# EAGLE design EL_Inverter (EAGLE 7.2.0)
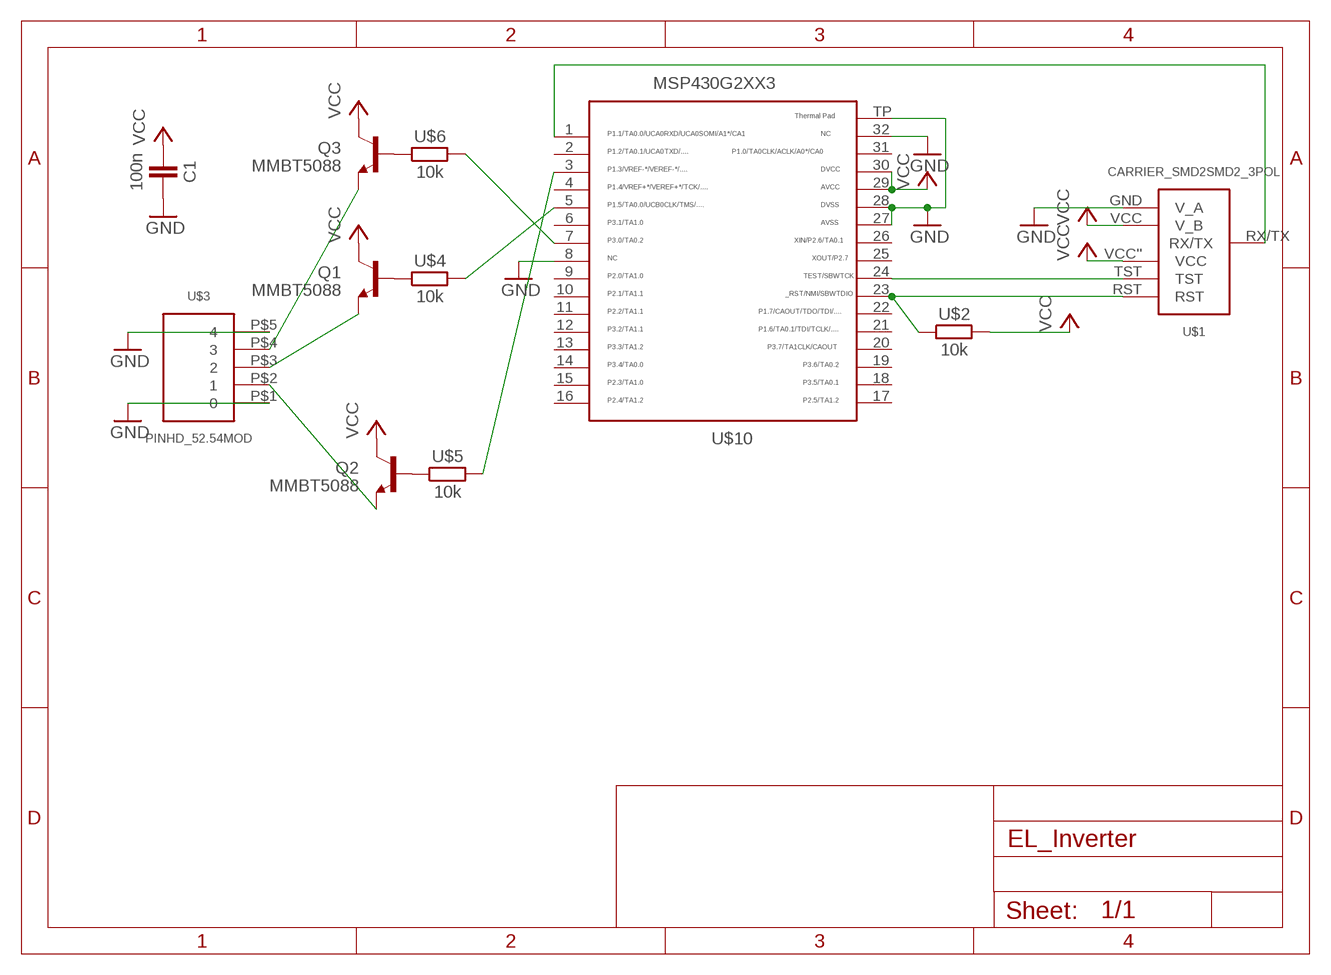
[diagram p0: schematic, sheet 1]

## Parts
C1  100n  CAPACITOR  [603]
Q1  MMBT5088  TRANSISTOR_NPNMMBT5088  [SOT23-3]
Q2  MMBT5088  TRANSISTOR_NPNMMBT5088  [SOT23-3]
Q3  MMBT5088  TRANSISTOR_NPNMMBT5088  [SOT23-3]
U$1  CARRIER_SMD2SMD2_3POL  [CARRIER_SMD2_3POL]
U$2  10k  RESISTOR0603  [603]
U$3  PINHD_52.54MOD  [PINHD_5_MOD]
U$4  10k  RESISTOR0603  [603]
U$5  10k  RESISTOR0603  [603]
U$6  10k  RESISTOR0603  [603]
U$10  MSP430G2553  [QFN32]

## Nets
GND: C1.2 U$1.GND(V_A) U$3.P$1 U$3.P$5 U$10.8 U$10.27 U$10.28 U$10.32 U$10.TP
N$2: Q1.1(B) U$4.1
N$3: U$1.TST U$10.24
N$4: U$1.RST U$2.1 U$10.23
N$5: Q2.1(B) U$5.1
N$6: Q2.2(E) U$3.P$2
N$7: Q1.2(E) U$3.P$3
N$11: Q3.1(B) U$6.1
N$12: U$1.RX/TX U$10.1
N$13: Q3.2(E) U$3.P$4
N$14: U$5.2 U$10.3
N$16: U$4.2 U$10.5
N$17: U$6.2 U$10.7
VCC: C1.1 Q1.3(C) Q2.3(C) Q3.3(C) U$1.VCC''(VCC) U$1.VCC(V_B) U$2.2 U$10.29 U$10.30
Unconnected: U$10.2 U$10.4 U$10.6 U$10.9 U$10.10 U$10.11 U$10.12 U$10.13 U$10.14 U$10.15 U$10.16 U$10.17 U$10.18 U$10.19 U$10.20 U$10.21 U$10.22 U$10.25 U$10.26 U$10.31

## Library data of the parts
C1 = thar:CAPACITOR
Q1-Q3 = SparkFun-DiscreteSemi:TRANSISTOR_NPN: Generic NPN BJT MMBT2222A - TRANS-08049 (SOT-23, 1A 40V) MPSA42 - TRANS-09116 (SOT-23, 500mA 300V) MMBT5088LT1G - TRANS-11160 (SOT-23, 50 mA 30V) BC547 - COM-08928 <http://www.sparkfun.com/products/8928> (TO-92 45V 100mA) (1.Collector 2.Base 3.Emitter) 2N3904 - COM-00521 <http://www.sparkfun.com/products/521> (TO-92 40V 200mA) (1.Emitter 2.Base 3.Collector) P2N2222A - COM-12852 <http://www.sparkfun.com/products/12852> (TO-92 40V 600mA) (1.Collector 2.Base 3.Emitter); PROD_ID: TRANS-11160
U$1 = thar:CARRIER_SMD2
U$2 U$4-U$6 = thar:RESISTOR
U$3 = thar:PINHD_5
U$10 = thar:MSP430G2553: TEXAS INSTRUMENTS MSP430G2553IRHB32R MCU, 16BIT, MSP430, 16MHZ, QFN-32 Farnell Best.Nr.: 2325726 Herst.Bez.: MSP430G2553IRHB32R

## Board
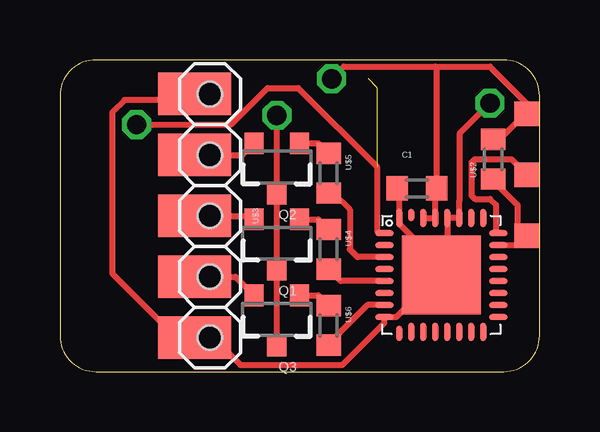
[diagram p1: board, top side]
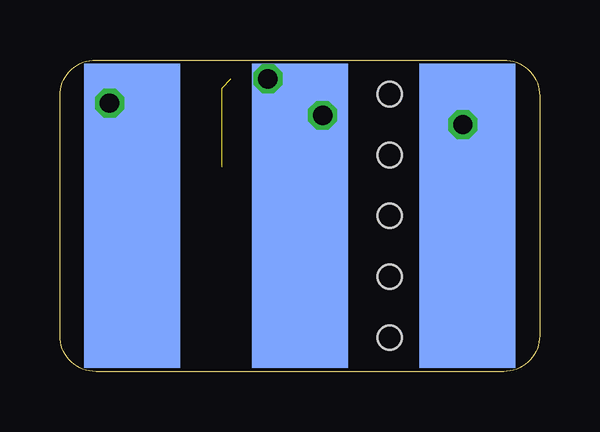
[diagram p2: board, bottom side, seen from below]

Size 20 x 13 mm. Coordinates in mm from the lower left corner, seen from the top.
Copper layers (1*16): Top 0.035mm / dielectric 1.5mm / Bottom 0.035mm
Design rules "Bilex DRU *": minimum track width 10mil, minimum drill 24mil, track to track 10mil, track to pad 10mil, pad to pad 10mil, via to via 10mil, smd to smd 10mil, copper to edge 1mil, drill to drill 8mil, minimum pad ring 10mil, minimum via ring 8mil, stop-mask expansion 4mil, vias tented up to drill 0mil, thermal gap 10mil

### Footprints (pad centres in the part's own frame; a part is rotated, then mirrored left to right if it is on the bottom)
603 = smd 0.889 x 1.016: 1 -0.826,0; 2 0.826,0
SOT23-3 = smd 0.8 x 0.9: 1 -0.95,-1; 2 0.95,-1; 3 0,1.1
CARRIER_SMD2_3POL = smd 4 x 12.7 bottom: GND -6.985,0; RX/TX 6.985,0; VCC 0,0 | smd 1.016 x 1.016: RST -9.461,0.826; TST -9.461,-1.714; VCC'' -9.461,-4.255
PINHD_5_MOD = smd 1.778 x 3.048: P$1 -5.08,-0.635; P$2 -2.54,-0.635; P$3 0,-0.635; P$4 2.54,-0.635; P$5 5.08,-0.635 | hole 1.016: -5.08,0; -2.54,0; 0,0; 2.54,0; 5.08,0
QFN32 = smd 0.762 x 0.254: 1 -2.375,1.75; 2 -2.375,1.25; 3 -2.375,0.75; 4 -2.375,0.25; 5 -2.375,-0.25; 6 -2.375,-0.75; 7 -2.375,-1.25; 8 -2.375,-1.75; 17 2.375,-1.75; 18 2.375,-1.25; 19 2.375,-0.75; 20 2.375,-0.25; 21 2.375,0.25; 22 2.375,0.75; 23 2.375,1.25; 24 2.375,1.75 | smd 0.254 x 0.635: 9 -1.75,-2.438 | smd 0.254 x 0.762: 10 -1.25,-2.375; 11 -0.75,-2.375; 12 -0.25,-2.375; 13 0.25,-2.375; 14 0.75,-2.375; 15 1.25,-2.375; 16 1.75,-2.375; 25 1.75,2.375; 26 1.25,2.375; 27 0.75,2.375; 28 0.25,2.375; 29 -0.25,2.375; 30 -0.75,2.375; 32 -1.75,2.375 | smd 0.254 x 0.508: 31 -1.25,2.5 | smd 3.302 x 3.302: TP 0,0

### Placement (x,y rotation side)
C1  14.89,7.64 180 top
Q1  9.04,5.35 180 top
Q2  9.04,8.53 180 top
Q3  9.04,2.18 180 top
U$1  10,6.5 180 top
U$2  18.06,8.86 90 top
U$3  6.25,6.5 270 top
U$4  11.2,5.1 270 top
U$5  11.2,8.28 270 top
U$6  11.2,1.92 270 top
U$10  15.9,4.03 0 top

### Tracks (layer width: path | path; a pad name or v marks a point on that pad's centre or on a via)
GND  (via drill 0.8)
  Top 0.254: 16.43,4.35 16.19,5.38 16.16,5.35 | 16.43,4.35 16.48,3.06 U$10.TP 15.01,2.94 14.89,3.14 14.03,2.28 U$10.8 13.53,2.03 11.78,0.27 7.52,0.27 6.38,1.42 U$3.P$5 4.35,1.92 3.58,2.69 2.19,4.08 2.19,10.81 2.7,11.32 4.6,11.32 4.6,11.58 U$3.P$1 | 16.15,4.72 U$10.28 U$10.27 16.65,7.12 16.66,7.13 16.66,9.93 v17.93,11.2 | 16.15,4.72 16.15,4.42 16.43,4.35 | 16.15,4.72 15.52,5.35 14.76,5.55 14.15,6.16 U$10.32 14.15,7.55 C1.2
  Bottom 0.254: 18,6.5 17.93,6.57 v17.93,11.2 16.98,10.25 U$1.GND
N$2
  Top 0.254: Q1.1 10.78,6.35 U$4.1
N$3
  Top 0.254: 19.61,7.88 19.46,8.02 19.5,8.18 | U$10.24 18.19,5.78 18.19,6.95 17.93,7.21 17.3,7.21 17.17,7.33 17.17,8.73 17.3,8.86 18.82,8.86 19.5,8.18 | 19.5,8.18 U$1.TST
N$4
  Top 0.254: 19.46,5.48 19.5,5.38 | 19.46,5.48 19.5,5.69 19.08,5.74 19.08,6.95 18.06,7.97 U$2.1 | U$10.23 19.28,5.28 19.46,5.48 | U$1.RST 19.46,5.48
N$5
  Top 0.254: Q2.1 10.78,9.53 U$5.1
N$6
  Top 0.254: U$3.P$2 7.6,9.04 Q2.2
N$7
  Top 0.254: U$3.P$3 7.95,6.5 Q1.2
N$11
  Top 0.254: Q3.1 10.78,3.18 U$6.1
N$12  (via drill 0.8)  (2 unrouted)
  Top 0.254: U$10.1 13.32,5.78 13.24,5.86 13.24,8.53 9.93,11.83 8.66,11.83 7.14,10.31 v3.2,10.31
  Bottom 0.254: U$1.RX/TX 3.01,11.77 v3.2,10.31
N$13
  Top 0.254: U$3.P$4 7.32,3.96 Q3.2
N$14
  Top 0.254: U$10.3 12.41,4.78 12.09,5.1 12.09,6.75 11.39,7.45 U$5.2
N$16
  Top 0.254: U$10.5 11.7,3.78 U$4.2
N$17
  Top 0.254: U$6.2 11.65,1.61 12.82,2.78 U$10.7
VCC  (via drill 0.8)
  Top 0.254: 19.5,10.52 19.46,10.56 | U$2.2 18.12,9.48 19.2,10.56 19.2,10.51 19.46,10.56 | 19.5,11.11 19.65,10.95 19.65,10.75 19.46,10.56 | U$1.VCC'' 19.46,11.07 19.5,11.11 | 19.5,11.11 19.5,11.16 17.93,12.72 15.65,12.72 | 15.65,12.72 11.84,12.72 v11.33,12.21 | U$10.30 U$10.29 15.65,7.58 C1.1 15.71,12.66 15.65,12.72 | Q3.3 Q1.3 | Q1.3 Q2.3 | Q1.3 v9.04,10.69
  Bottom 0.254: U$1.VCC 10,10.25 | 10,10.25 v11.33,12.21 | 10,10.25 9.49,10.25 v9.04,10.69